# Altium project Remote_Circuit.PrjPcb
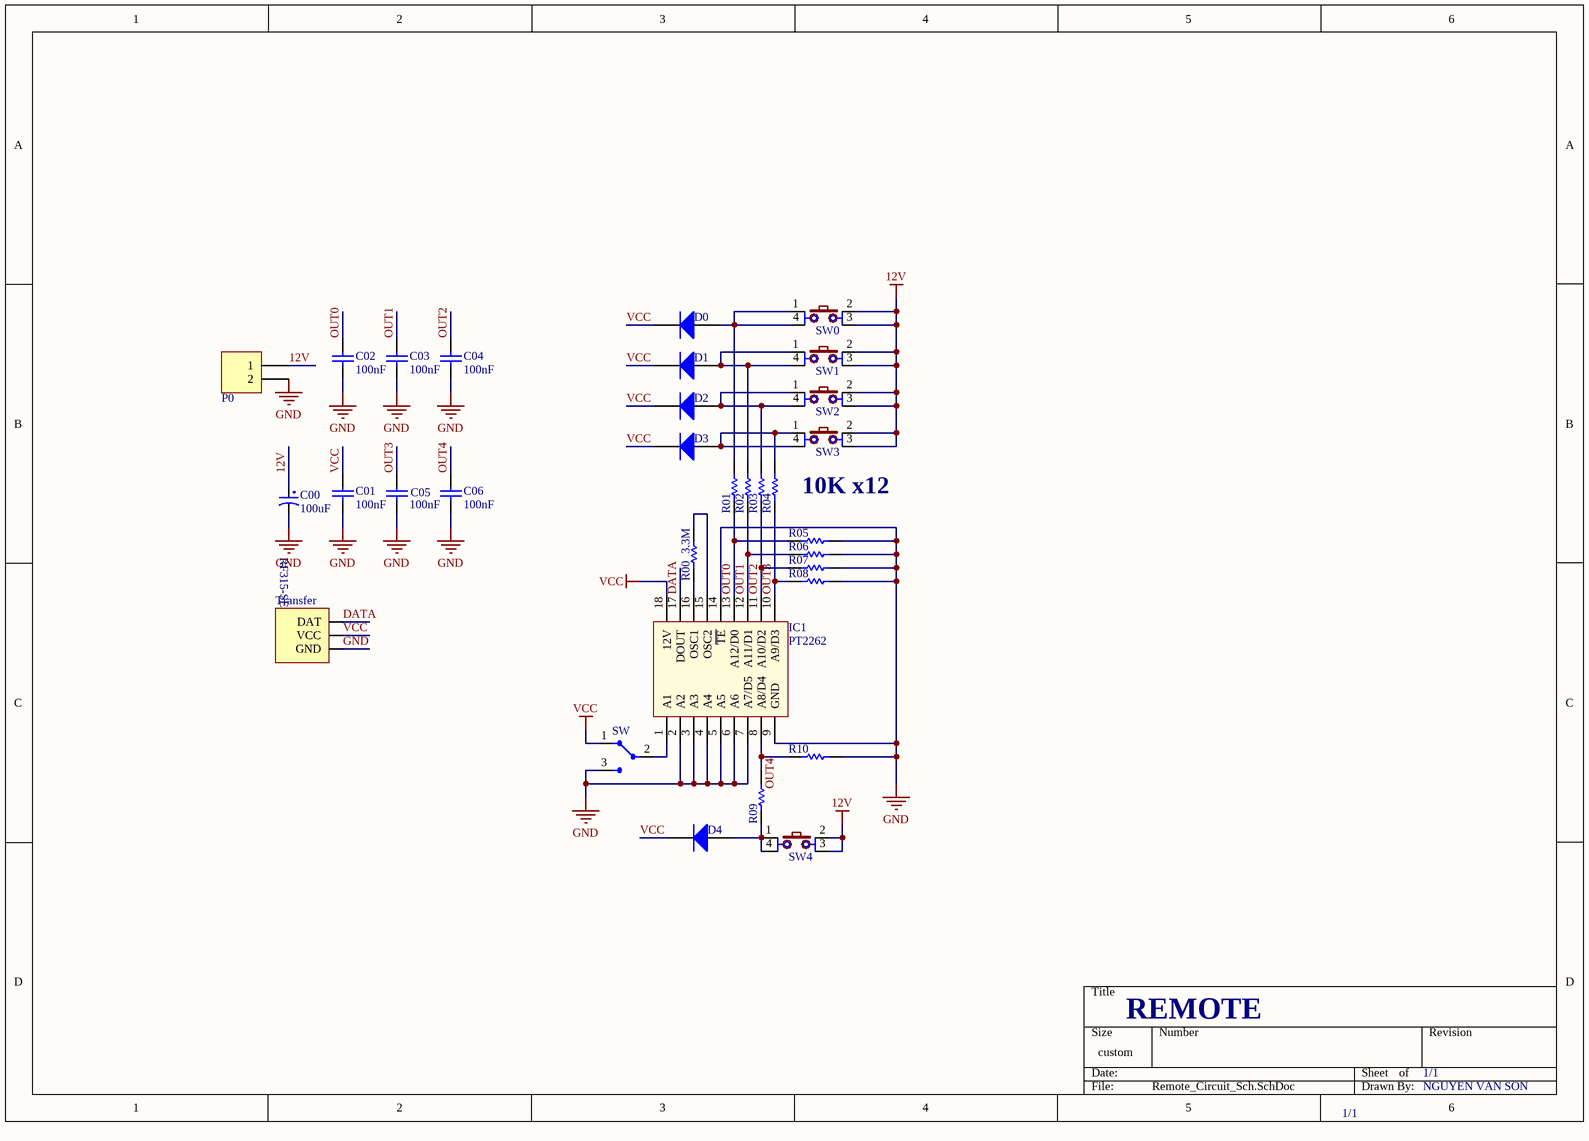
[diagram p0: Remote_Circuit_Sch.SchDoc]
1 sheet, 32 parts. Net scope: global (net labels, ports and power ports of the same name join across sheets).
Board file: Remote_Circuit_Pcb.PcbDoc

## Sheet Remote_Circuit_Sch.SchDoc
size 297 x 209 mm; SheetNumber: 1; SheetTotal: 1

### Parts
C00  100uF  [tu tantalum smd7343]
C01  value 100nF  [CAP-SM-0603]  (hidden comment: Cap Non-Pol SMD)
C02  value 100nF  [CAP-SM-0603]  (hidden comment: Cap Non-Pol SMD)
C03  value 100nF  [CAP-SM-0603]  (hidden comment: Cap Non-Pol SMD)
C04  value 100nF  [CAP-SM-0603]  (hidden comment: Cap Non-Pol SMD)
C05  value 100nF  [CAP-SM-0603]  (hidden comment: Cap Non-Pol SMD)
C06  value 100nF  [CAP-SM-0603]  (hidden comment: Cap Non-Pol SMD)
D0  M7  [DIODE SMA]  (value not drawn)
D1  M7  [DIODE SMA]  (value not drawn)
D2  M7  [DIODE SMA]  (value not drawn)
D3  M7  [DIODE SMA]  (value not drawn)
D4  M7  [DIODE SMA]  (value not drawn)
IC1  PT2262  [DIP18]
P0  Domino 2  [DOMINO SMALL 2]  (value not drawn)
R00  value 3.3M  [RES-SM-0603]  (hidden comment: RESISTOR SMD)
R01  RESISTOR SMD  [RES-SM-0603]  (value not drawn)
R02  RESISTOR SMD  [RES-SM-0603]  (value not drawn)
R03  RESISTOR SMD  [RES-SM-0603]  (value not drawn)
R04  RESISTOR SMD  [RES-SM-0603]  (value not drawn)
R05  RESISTOR SMD  [RES-SM-0603]  (value not drawn)
R06  RESISTOR SMD  [RES-SM-0603]  (value not drawn)
R07  RESISTOR SMD  [RES-SM-0603]  (value not drawn)
R08  RESISTOR SMD  [RES-SM-0603]  (value not drawn)
R09  RESISTOR SMD  [RES-SM-0603]  (value not drawn)
R10  RESISTOR SMD  [RES-SM-0603]  (value not drawn)
SW  Component_1  [Slide Switch]  (value not drawn)
SW0  SW  [SW2-DIP]  (value not drawn)
SW1  SW  [SW2-DIP]  (value not drawn)
SW2  SW  [SW2-DIP]  (value not drawn)
SW3  SW  [SW2-DIP]  (value not drawn)
SW4  SW  [SW2-DIP]  (value not drawn)
Transfer  RF315-DEND-NOIC  [RF315-SEND-NOIC]  (value not drawn)

### Nets
12V: C00.1 P0.1 SW0.2 SW0.3 SW1.2 SW1.3 SW2.2 SW2.3 SW3.2 SW3.3 SW4.2 SW4.3
GND: C00.2 C01.1 C02.1 C03.1 C04.1 C05.1 C06.1 IC1.2(A2) IC1.3(A3) IC1.4(A4) IC1.5(A5) IC1.6(A6) IC1.7(A7/D5) IC1.9(GND) IC1.14(~{TE}) P0.2 R05.1 R06.1 R07.1 R08.1 R10.1 SW.3(I/O2) Transfer.3(GND)
VCC: C01.2 D0.2(K) D1.2(K) D2.2(K) D3.2(K) D4.2(K) IC1.18(12V) SW.1 Transfer.2(VCC)
DATA: IC1.17(DOUT) Transfer.1(DAT)
OUT0: C02.2 IC1.13(A12/D0) R01.1 R05.2
OUT1: C03.2 IC1.12(A11/D1) R02.1 R06.2
OUT2: C04.2 IC1.11(A10/D2) R03.1 R07.2
OUT3: C05.2 IC1.10(A9/D3) R04.1 R08.2
OUT4: C06.2 IC1.8(A8/D4) R09.1 R10.2
NetD0_1: D0.1(A) R01.2 SW0.1 SW0.4
NetD1_1: D1.1(A) R02.2 SW1.1 SW1.4
NetD2_1: D2.1(A) R03.2 SW2.1 SW2.4
NetD3_1: D3.1(A) R04.2 SW3.1 SW3.4
NetD4_1: D4.1(A) R09.2 SW4.1 SW4.4
NetIC1_1: IC1.1(A1) SW.2
NetIC1_15: IC1.15(OSC2) R00.1
NetIC1_16: IC1.16(OSC1) R00.2

### Notes on the sheet
- 10K x12
- REMOTE
- 1/1
- NGUYEN VAN SON
- (in symbol RF315-DEND-NOIC) RF315-SE

### Library data of the parts
C00 = Tu tantalum 100uF 50V SMD7343: Dán; Don_Vi: Con; So_Chan: 2; Ten_Linh_Kien: Tụ tantalum 107T-100uF 50V SMD7343; Ma_Hang: MH008401; Chung_Loai: Dán; Kieu_Chan: *
C01 C02 C03 C04 C05 C06 = Cap Non-Pol SMD: Capacitor
D0-D4 = Diode M7 ( 4007 ): Dán; Don_Vi: Con; Ten_Linh_Kien: Diode M7 1N4007 SMD 1A 1000V; Ma_Hang: MH000944; Chung_Loai: Dán; Ghi_Chu: *
IC1 = PT2262: Remote Control Encoder
P0 = Domino 2: Domino, 2-Pin; LatestRevisionDate: 17-Jul-2002; LatestRevisionNote: Re-released for DXP Platform.; Publisher: Altium Limited
R00 R05 R06 R07 R08 R09 R10 = RESISTOR SMD: Resistor
R01 R02 R03 R04 = RESISTOR SMD: Resistor; Value: 2.7K
SW0-SW4 = SW4: Switch button 4 pin; Value: Button chip 4 pin
Transfer = RF315-DEND-NOIC: Manufacturer: W¨¹rth Elektronik eiSos GmbH; partNo: 613004143121; ComponentLink1 Description: Manufacturer; ComponentLink2 Description: Datasheet; NoPins: 04; Created Date: 29 March 2013; ComponentLink1URL: http://www.we-online.com; ComponentLink2URL: http://katalog.we-online.de/em/datasheet/6130xx143121.pdf; Created by: Karrer Zheng